# Altium schematic sheet SM3320-BATT-EV.SchDoc: ChangeMe
size C; Date: Not shown in title block; ApprovedBy: Not shown in title block; CheckedBy: Not shown in title block; Author: Not shown in title block; CompanyName: Not shown in title block; DrawnBy: Not shown in title block; Engineer: Not shown in title block; Organization: Not shown in title block; Address1: Not shown in title block; Address2: Not shown in title block; Address3: Not shown in title block; Address4: Not shown in title block; DocumentNumber: 1; Revision: Use project parameter SCH_Rev; SheetNumber: 1; SheetTotal: 1; PageSetup: Record=PageOptions|CenterHorizontal=True|CenterVertical=True|PrintScale=0.85|XCorrection=0.00|YCorrection=0.00|PrintKind=2|BorderSize=5000000|LeftOffset=0|BottomOffset=0|Orientation=2|PaperLength=1000|PaperWidth=1000|Scale=100|PaperSource=15|PrintQuality=600|MediaType=1|DitherType=10|PaperKind=11x17|PrintScaleMode=0; CurrentTime: Not shown in title block; CurrentDate: Not shown in title block; Time: Not shown in title block; DocumentFullPathAndName: Not shown in title block; DocumentName: Not shown in title block; ModifiedDate: Not shown in title block; ImagePath: Not shown in title block
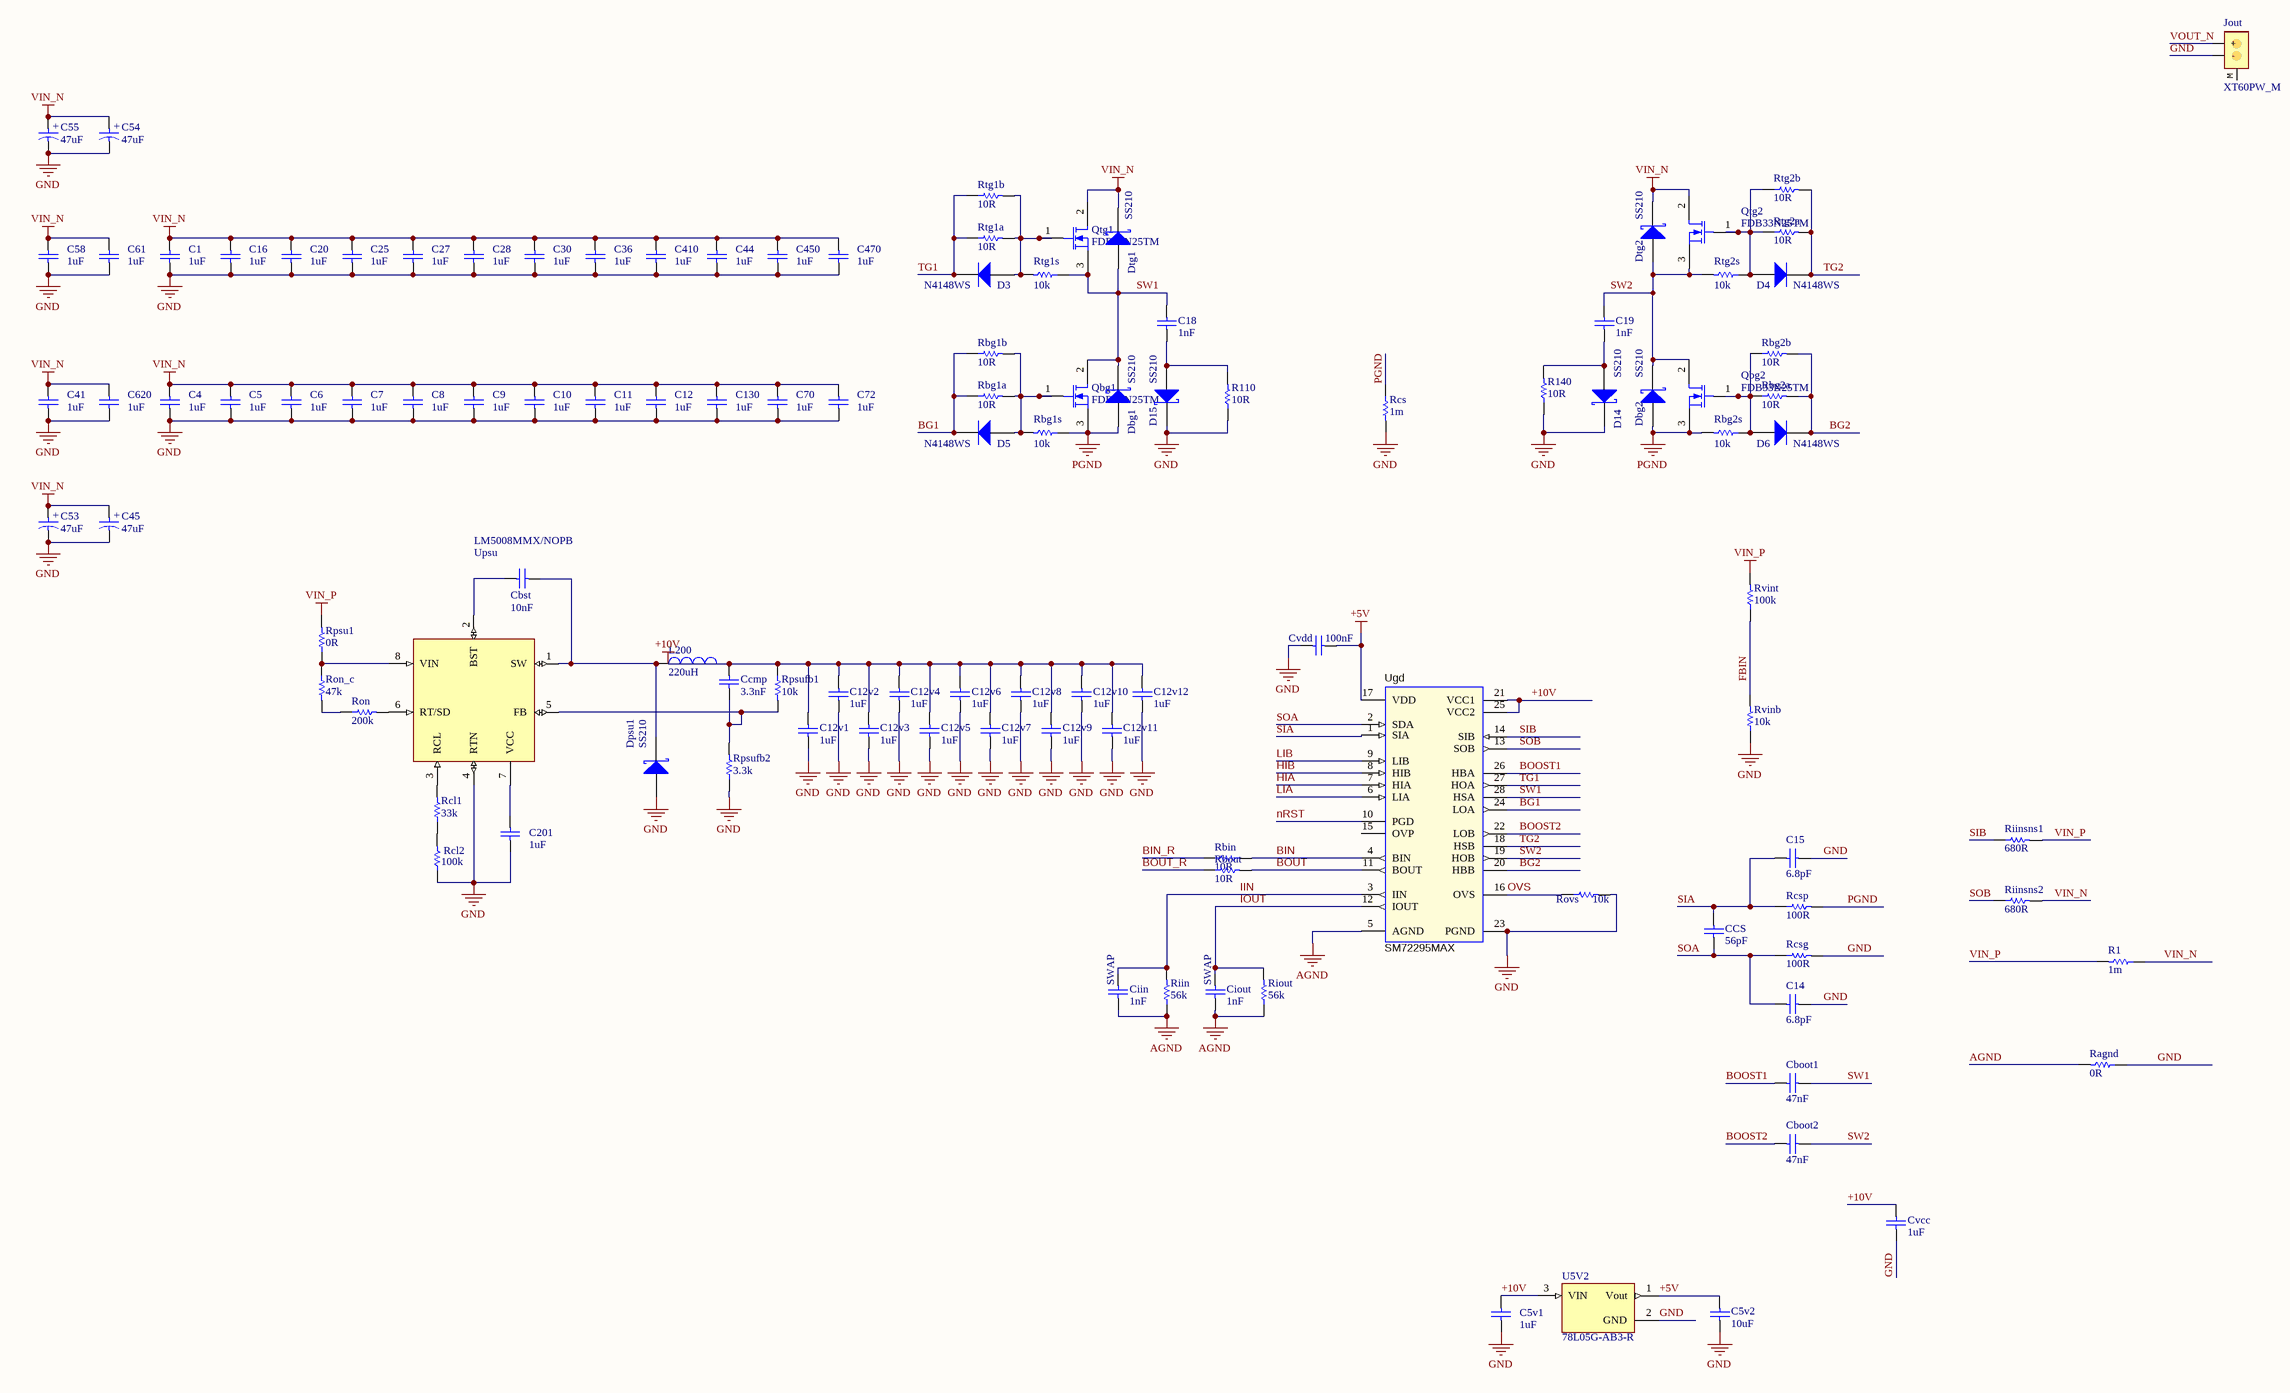
[diagram p0: SM3320-BATT-EV.SchDoc]

## Parts
C1  value 1uF  [C_1206]  (hidden comment: 1206B105K101NT)
C4  value 1uF  [C_1206]  (hidden comment: 1206B105K101NT)
C5  value 1uF  [C_1206]  (hidden comment: 1206B105K101NT)
C5v1  value 1uF  [C_0402]  (hidden comment: CL05A105KA5NQNC)
C5v2  value 10uF  [C_0402]  (hidden comment: CL05A106MQ5NUNC)
C6  value 1uF  [C_1206]  (hidden comment: 1206B105K101NT)
C7  value 1uF  [C_1206]  (hidden comment: 1206B105K101NT)
C8  value 1uF  [C_1206]  (hidden comment: 1206B105K101NT)
C9  value 1uF  [C_1206]  (hidden comment: 1206B105K101NT)
C10  value 1uF  [C_1206]  (hidden comment: 1206B105K101NT)
C11  value 1uF  [C_1206]  (hidden comment: 1206B105K101NT)
C12  value 1uF  [C_1206]  (hidden comment: 1206B105K101NT)
C12v1  value 1uF  [C_0402]  (hidden comment: CL05A105KA5NQNC)
C12v2  value 1uF  [C_0402]  (hidden comment: CL05A105KA5NQNC)
C12v3  value 1uF  [C_0402]  (hidden comment: CL05A105KA5NQNC)
C12v4  value 1uF  [C_0402]  (hidden comment: CL05A105KA5NQNC)
C12v5  value 1uF  [C_0402]  (hidden comment: CL05A105KA5NQNC)
C12v6  value 1uF  [C_0402]  (hidden comment: CL05A105KA5NQNC)
C12v7  value 1uF  [C_0402]  (hidden comment: CL05A105KA5NQNC)
C12v8  value 1uF  [C_0402]  (hidden comment: CL05A105KA5NQNC)
C12v9  value 1uF  [C_0402]  (hidden comment: CL05A105KA5NQNC)
C12v10  value 1uF  [C_0402]  (hidden comment: CL05A105KA5NQNC)
C12v11  value 1uF  [C_0402]  (hidden comment: CL05A105KA5NQNC)
C12v12  value 1uF  [C_0402]  (hidden comment: CL05A105KA5NQNC)
C14  value 6.8pF  [C_0402]  (hidden comment: 0402CG6R8C500NT)
C15  value 6.8pF  [C_0402]  (hidden comment: 0402CG6R8C500NT)
C16  value 1uF  [C_1206]  (hidden comment: 1206B105K101NT)
C18  value 1nF  [C_1206]  (hidden comment: 1206B102K202NT)
C19  value 1nF  [C_1206]  (hidden comment: 1206B102K202NT)
C20  value 1uF  [C_1206]  (hidden comment: 1206B105K101NT)
C25  value 1uF  [C_1206]  (hidden comment: 1206B105K101NT)
C27  value 1uF  [C_1206]  (hidden comment: 1206B105K101NT)
C28  value 1uF  [C_1206]  (hidden comment: 1206B105K101NT)
C30  value 1uF  [C_1206]  (hidden comment: 1206B105K101NT)
C36  value 1uF  [C_1206]  (hidden comment: 1206B105K101NT)
C41  value 1uF  [C_1206]  (hidden comment: 1206B105K101NT)
C44  value 1uF  [C_1206]  (hidden comment: 1206B105K101NT)
C45  value 47uF  [C_CAN_1010]  (hidden comment: VZH470M2ATR-1010)
C53  value 47uF  [C_CAN_1010]  (hidden comment: VZH470M2ATR-1010)
C54  value 47uF  [C_CAN_1010]  (hidden comment: VZH470M2ATR-1010)
C55  value 47uF  [C_CAN_1010]  (hidden comment: VZH470M2ATR-1010)
C58  value 1uF  [C_1206]  (hidden comment: 1206B105K101NT)
C61  value 1uF  [C_1206]  (hidden comment: 1206B105K101NT)
C70  value 1uF  [C_1206]  (hidden comment: 1206B105K101NT)
C72  value 1uF  [C_1206]  (hidden comment: 1206B105K101NT)
C130  value 1uF  [C_1206]  (hidden comment: 1206B105K101NT)
C201  value 1uF  [C_0402]  (hidden comment: CL05A105KA5NQNC)
C410  value 1uF  [C_1206]  (hidden comment: 1206B105K101NT)
C450  value 1uF  [C_1206]  (hidden comment: 1206B105K101NT)
C470  value 1uF  [C_1206]  (hidden comment: 1206B105K101NT)
C620  value 1uF  [C_1206]  (hidden comment: 1206B105K101NT)
Cboot1  value 47nF  [C_0603]  (hidden comment: CL10B474KA8NNNC)
Cboot2  value 47nF  [C_0603]  (hidden comment: CL10B474KA8NNNC)
Cbst  value 10nF  [C_0402]  (hidden comment: CL05B103KB5NNNC)
Ccmp  value 3.3nF  [C_0402]  (hidden comment: CL05B332KB5NNNC)
CCS  value 56pF  [C_0402]  (hidden comment: 0402CG560J500NT)
Ciin  value 1nF  [C_0402]  (hidden comment: 0402B102K500NT)
Ciout  value 1nF  [C_0402]  (hidden comment: 0402B102K500NT)
Cvcc  value 1uF  [C_0402]  (hidden comment: CL05A105KA5NQNC)
Cvdd  value 100nF  [C_0402]  (hidden comment: CL05B104KO5NNNC)
D3  N4148WS  [SOD-323]
D4  N4148WS  [SOD-323]
D5  N4148WS  [SOD-323]
D6  N4148WS  [SOD-323]
D14  SS210  [DO-214AC]
D15  SS210  [DO-214AC]
Dbg1  SS210  [DO-214AC]
Dbg2  SS210  [DO-214AC]
Dpsu1  SS210  [DO-214AC]
Dtg1  SS210  [DO-214AC]
Dtg2  SS210  [DO-214AC]
Jout  XT60PW_M  [XT60PW_M]
L200  value 220uH  [SRR1260]  (hidden comment: SWRB1207S-221MT)
Qbg1  FDB33N25TM  [TO-263-3]
Qbg2  FDB33N25TM  [TO-263-3]
Qtg1  FDB33N25TM  [TO-263-3]
Qtg2  FDB33N25TM  [TO-263-3]
R1  1m  [R_2512]
R110  value 10R  [R_1206]  (hidden comment: 1206W4F100JT5E)
R140  value 10R  [R_1206]  (hidden comment: 1206W4F100JT5E)
Ragnd  value 0R  [R_0402]  (hidden comment: 0402WGF0000TCE)
Rbg1a  value 10R  [R_0402]  (hidden comment: 0402WGF100JTCE)
Rbg1b  value 10R  [R_0402]  (hidden comment: 0402WGF100JTCE)
Rbg1s  value 10k  [R_0402]  (hidden comment: 0402WGF1002TCE)
Rbg2a  value 10R  [R_0402]  (hidden comment: 0402WGF100JTCE)
Rbg2b  value 10R  [R_0402]  (hidden comment: 0402WGF100JTCE)
Rbg2s  value 10k  [R_0402]  (hidden comment: 0402WGF1002TCE)
Rbin  value 10R  [R_0402]  (hidden comment: 0402WGF100JTCE)
Rbout  value 10R  [R_0402]  (hidden comment: 0402WGF100JTCE)
Rcl1  value 33k  [R_0402]  (hidden comment: 0402WGF3302TCE)
Rcl2  value 100k  [R_0402]  (hidden comment: 0402WGF1003TCE)
Rcs  1m  [R_2512]
Rcsg  value 100R  [R_0402]  (hidden comment: 0402WGF1000TCE)
Rcsp  value 100R  [R_0402]  (hidden comment: 0402WGF1000TCE)
Riin  value 56k  [R_0402]  (hidden comment: 0402WGF5602TCE)
Riinsns1  value 680R  [R_0603]  (hidden comment: 0603WAF6800T5E)
Riinsns2  value 680R  [R_0603]  (hidden comment: 0603WAF6800T5E)
Riout  value 56k  [R_0402]  (hidden comment: 0402WGF5602TCE)
Ron  value 200k  [R_0402]  (hidden comment: 0402WGF2003TCE)
Ron_c  value 47k  [R_0402]  (hidden comment: 0402WGF4702TCE)
Rovs  value 10k  [R_0402]  (hidden comment: 0402WGF1002TCE)
Rpsu1  value 0R  [R_0402]  (hidden comment: 0402WGF0000TCE)
Rpsufb1  value 10k  [R_0402]  (hidden comment: 0402WGF1002TCE)
Rpsufb2  value 3.3k  [R_0402]  (hidden comment: 0402WGF3301TCE)
Rtg1a  value 10R  [R_0402]  (hidden comment: 0402WGF100JTCE)
Rtg1b  value 10R  [R_0402]  (hidden comment: 0402WGF100JTCE)
Rtg1s  value 10k  [R_0402]  (hidden comment: 0402WGF1002TCE)
Rtg2a  value 10R  [R_0402]  (hidden comment: 0402WGF100JTCE)
Rtg2b  value 10R  [R_0402]  (hidden comment: 0402WGF100JTCE)
Rtg2s  value 10k  [R_0402]  (hidden comment: 0402WGF1002TCE)
Rvinb  value 10k  [R_0603]  (hidden comment: 0603WAF1002T5E)
Rvint  value 100k  [R_0603]  (hidden comment: 0603WAF100KT5E)
U5V2  78L05G-AB3-R  [SOT-223-3]
Ugd  SM72295MAX  [M28B_M]
Upsu  LM5008MMX/NOPB  [SOP65P490X110-8N]

## Nets
+5V: C5v2.2 Cvdd.2 U5V2.1(Vout) Ugd.17(VDD)
+10V: C5v1.2 C12v1.1 C12v2.1 C12v3.1 C12v4.1 C12v5.1 C12v6.1 C12v7.1 C12v8.1 C12v9.1 C12v10.1 C12v11.1 C12v12.1 Ccmp.2 Cvcc.2 L200.2 Rpsufb1.1 U5V2.3(VIN) Ugd.21(VCC1) Ugd.25(VCC2)
AGND: Ciin.1 Ciout.1 Ragnd.2 Riin.1 Riout.1 Ugd.5(AGND)
GND: C1.1 C4.1 C5.1 C5v1.1 C5v2.1 C6.1 C7.1 C8.1 C9.1 C10.1 C11.1 C12.1 C12v1.2 C12v2.2 C12v3.2 C12v4.2 C12v5.2 C12v6.2 C12v7.2 C12v8.2 C12v9.2 C12v10.2 C12v11.2 C12v12.2 C14.2 C15.2 C16.1 C20.1 C25.1 C27.1 C28.1 C30.1 C36.1 C41.1 C44.1 C45.1 C53.1 C54.1 C55.1 C58.1 C61.1 C70.1 C72.1 C130.1 C201.2 C410.1 C450.1 C470.1 C620.1 Cvcc.1 Cvdd.1 D14.1(K) D15.1(K) Dpsu1.2(A) Jout.MINUS(-) R110.1 R140.1 Ragnd.1 Rcl2.1 Rcs.2 Rcsg.2 Rovs.2 Rpsufb2.1 Rvinb.1 U5V2.2(GND) Ugd.23(PGND) Upsu.4(RTN)
PGND: Dbg1.2(A) Dbg2.2(A) Qbg1.3(S) Qbg2.3(S) Rbg1s.1 Rbg2s.2 Rcs.1 Rcsp.2
VIN_N: C1.2 C4.2 C5.2 C6.2 C7.2 C8.2 C9.2 C10.2 C11.2 C12.2 C16.2 C20.2 C25.2 C27.2 C28.2 C30.2 C36.2 C41.2 C44.2 C45.2 C53.2 C54.2 C55.2 C58.2 C61.2 C70.2 C72.2 C130.2 C410.2 C450.2 C470.2 C620.2 Dtg1.1(K) Dtg2.1(K) Qtg1.2(D) Qtg2.2(D) R1.1 Riinsns2.2
VIN_P: R1.2 Riinsns1.2 Rpsu1.2 Rvint.2
BG1: D5.1(K) Rbg1a.1 Rbg1b.1 Ugd.24(LOA)
BG2: D6.1(K) Rbg2a.2 Rbg2b.2 Ugd.20(HBB)
BIN: Rbin.2 Ugd.4(BIN)
BIN_R: Rbin.1
BOOST1: Cboot1.2 Ugd.26(HBA)
BOOST2: Cboot2.2 Ugd.22(LOB)
BOUT: Rbout.2 Ugd.11(BOUT)
BOUT_R: Rbout.1
FBIN: Rvinb.2 Rvint.1
HIA: Ugd.7(HIA)
HIB: Ugd.8(HIB)
IIN: Ciin.2 Riin.2 Ugd.3(IIN)
IOUT: Ciout.2 Riout.2 Ugd.12(IOUT)
LIA: Ugd.6(LIA)
LIB: Ugd.9(LIB)
nRST: Ugd.10(PGD)
OVS: Rovs.1 Ugd.16(OVS)
SIA: C15.1 CCS.2 Rcsp.1 Ugd.1(SIA)
SIB: Riinsns1.1 Ugd.14(SIB)
SOA: C14.1 CCS.1 Rcsg.1 Ugd.2(SDA)
SOB: Riinsns2.1 Ugd.13(SOB)
SW1: C18.2 Cboot1.1 Dbg1.1(K) Dtg1.2(A) Qbg1.2(D) Qtg1.3(S) Rtg1s.1 Ugd.28(HSA)
SW2: C19.2 Cboot2.1 Dbg2.1(K) Dtg2.2(A) Qbg2.2(D) Qtg2.3(S) Rtg2s.2 Ugd.19(HOB)
TG1: D3.1(K) Rtg1a.1 Rtg1b.1 Ugd.27(HOA)
TG2: D4.1(K) Rtg2a.2 Rtg2b.2 Ugd.18(HSB)
VOUT_N: Jout.PLUS(+)
NetC18_1: C18.1 D15.2(A) R110.2
NetC19_1: C19.1 D14.2(A) R140.2
NetC201_1: C201.1 Upsu.7(VCC)
NetCbst_1: Cbst.1 Upsu.2(BST)
NetCbst_2: Cbst.2 Dpsu1.1(K) L200.1 Upsu.1(SW)
NetCcmp_1: Ccmp.1 Rpsufb1.2 Rpsufb2.2 Upsu.5(FB)
NetD3_2: D3.2(A) Qtg1.1(G) Rtg1a.2 Rtg1b.2 Rtg1s.2
NetD4_2: D4.2(A) Qtg2.1(G) Rtg2a.1 Rtg2b.1 Rtg2s.1
NetD5_2: D5.2(A) Qbg1.1(G) Rbg1a.2 Rbg1b.2 Rbg1s.2
NetD6_2: D6.2(A) Qbg2.1(G) Rbg2a.1 Rbg2b.1 Rbg2s.1
NetRcl1_1: Rcl1.1 Rcl2.2
NetRcl1_2: Rcl1.2 Upsu.3(RCL)
NetRon_1: Ron.1 Ron_c.2
NetRon_2: Ron.2 Upsu.6(RT/SD)
NetRon_c_1: Ron_c.1 Rpsu1.1 Upsu.8(VIN)

Not connected (* = marked no-connect by the designer): Jout M; Ugd 15(OVP)

## Notes on the sheet
- (near Ciin) SWAP
- (near Ciout) SWAP
- Title
- Size:
- Date:
- File:
- C
- Number:
- Time:
- Revision:
- Sheet
- of
- (in symbol VZH470M2ATR-1010) +

## Library data of the parts
C1 C4-C12 C16 C20 C25 C27 C28 C30 C36 C41 C44 C58 C61 C70 C72 C130 C410 C450 C470 C620 = 1206B105K101NT: C - CAPACITOR - MLCC - 1uF - 100V - 1206 - X7R; WVDC: 100; LCSC Part #: C91151; JLC Availability: Extended
C5v1 C12v1-C12v12 C201 Cvcc = CL05A105KA5NQNC: C - CAPACITOR - MLCC - 1uF - 25V - 0402; WVDC: 16; LCSC Part #: C52923; JLC Availability: Basic
C5v2 = CL05A106MQ5NUNC: C - CAPACITOR - MLCC - 10uF - 6.3V - 0402; WVDC: 6.3; LCSC Part #: C15525; JLC Availability: Basic
C14 C15 = 0402CG6R8C500NT: C - CAPACITOR - MLCC - 6.8pF - 50V - 0402; WVDC: 50; LCSC Part #: C1576; JLC Availability: Basic
C18 C19 = 1206B102K202NT: C - CAPACITOR - MLCC - 1nF - 2000V - 1206 - X7R; WVDC: 2000; LCSC Part #: C9196; JLC Availability: Basic
C45 C53-C55 = VZH470M2ATR-1010: C - CAPACITOR - ELECTROLYTIC - 47uF - 100V; WVDC: 100; ESR: 40mOhm; LCSC Part #: C164068; JLC Availability: Extended
Cboot1 Cboot2 = CL10B474KA8NNNC: C - CAPACITOR - MLCC - 470nF - 25V - 0603; WVDC: 25; LCSC Part #: C1623; JLC Availability: Basic
Cbst = CL05B103KB5NNNC: C - CAPACITOR - MLCC - 10nF - 50V - 0402; WVDC: 50; LCSC Part #: C15195; JLC Availability: Basic
Ccmp = CL05B332KB5NNNC: C - CAPACITOR - MLCC - 3.3nF - 50V - 0402; WVDC: 50; LCSC Part #: C26404; JLC Availability: Basic
CCS = 0402CG560J500NT: C - CAPACITOR - MLCC - 56pF - 50V -  0402; WVDC: 50; LCSC Part #: C1572; JLC Availability: Basic
Ciin Ciout = 0402B102K500NT: C - CAPACITOR - MLCC - 1nF - 50V - 0402; WVDC: 50; LCSC Part #: C1523; JLC Availability: Basic
Cvdd = CL05B104KO5NNNC: C - CAPACITOR - MLCC - 100nF - 16V - 0402; WVDC: 16; LCSC Part #: C1525; JLC Availability: Basic
D3-D6 = N4148WS: D - DIODE - FAST TRR - 100V - 150mA - 4ns; LCSC Part #: C2128; JLC Availability: Basic; PIV: 100V; If: 150mA; Trr: 4ns
D14 D15 Dbg1 Dbg2 Dpsu1 Dtg1 Dtg2 = SS210: D - DIODE - SCHOTTKY - 100V - 2A; Vrrm: 100; If: 2A; LCSC Part #: C14996; JLC Availability: Extended
Jout = XT60PW_M: J - JACK - POWER - XT60 - RIGHT - MALE; LCSC Part #: X; JLC Availability: None
L200 = SWRB1207S-221MT: L - INDUCTOR - 220uH - 1.6A - 12.5mm; Isat: 1.6A; LCSC Part #: C169380; JLC Availability: Extended
Qbg1 Qbg2 Qtg1 Qtg2 = FDB33N25TM: Q - TRANSISTOR - MOSFET (N) - 250V - 33A - 0.094R; WVDC: 250; LCSC Part #: C241752; JLC Availability: Extended
R1 Rcs = FMF25FPJR005-LH: R - RESISTOR - SMD - 0.005R - 1% - 2512 - 2W; LCSC Part #: C371096; JLC Availability: Extended; ComponentLink1URL: http://riedon.com/media/pdf/CSR.pdf; ComponentLink1Description: http://riedon.com/media/pdf/CSR.pdf; Power: 2W
R110 R140 = 1206W4F100JT5E: R - RESISTOR - SMD - 10R - 1% - 1206; LCSC Part #: C17903; JLC Availability: Basic
Ragnd Rpsu1 = 0402WGF0000TCE: R - RESISTOR - SMD - 0R - 1% - 0402; LCSC Part #: C17168; JLC Availability: Basic
Rbg1a Rbg1b Rbg2a Rbg2b Rbin Rbout Rtg1a Rtg1b Rtg2a Rtg2b = 0402WGF100JTCE: R - RESISTOR - SMD - 10R - 1% - 0402; LCSC Part #: C25077; JLC Availability: Basic
Rbg1s Rbg2s Rovs Rpsufb1 Rtg1s Rtg2s = 0402WGF1002TCE: R - RESISTOR - SMD - 10k - 1% - 0402; LCSC Part #: C25744; JLC Availability: Basic
Rcl1 = 0402WGF3302TCE: R - RESISTOR - SMD - 33k - 1% - 0402; LCSC Part #: C25779; JLC Availability: Basic
Rcl2 = 0402WGF1003TCE: R - RESISTOR - SMD - 100k - 1% -  0402; LCSC Part #: C25741; JLC Availability: Basic
Rcsg Rcsp = 0402WGF1000TCE: R - RESISTOR - SMD - 100R - 1% - 0402; LCSC Part #: C25076; JLC Availability: Basic
Riin Riout = 0402WGF5602TCE: R - RESISTOR - SMD - 56k - 1% - 0402; LCSC Part #: C25796; JLC Availability: Basic
Riinsns1 Riinsns2 = 0603WAF6800T5E: R - RESISTOR - SMD - 680R - 1% - 0603; LCSC Part #: C23228; JLC Availability: Basic
Ron = 0402WGF2003TCE: R - RESISTOR - SMD - 200k - 1% - 0402; LCSC Part #: C25764; JLC Availability: Basic
Ron_c = 0402WGF4702TCE: R - RESISTOR - SMD - 47k - 1% - 0402; LCSC Part #: C25792; JLC Availability: Basic
Rpsufb2 = 0402WGF3301TCE: R - RESISTOR - SMD - 3.3k - 1% - 0402; LCSC Part #: C25890; JLC Availability: Basic
Rvinb = 0603WAF1002T5E: R - RESISTOR - SMD - 10k - 1% - 0603; LCSC Part #: C25804; JLC Availability: Basic
Rvint = 0603WAF100KT5E: R - RESISTOR - SMD - 100k - 1% -  0603; LCSC Part #: C22936; JLC Availability: Basic
U5V2 = 78L05G-AB3-R: U - IC - 5V Power Regulator; VOut: 5.0; LCSC Part #: C71136; JLC Availability: Basic
Ugd = SM72295: Photovoltaic Full Bridge Driver; Manufacturer: National Semiconductor; PackageTopMarking: S13051; ComponentLink1Description: Solar Magic Website; ComponentLink1URL: http://www.solarmagic.com; CompType: Driver; PackageReference: M28B_N; PartNumber: SM72295; RoHS: Y; PinCount: 28; PackageDescription: SOIC-28
Upsu = LM5008MMX/NOPB: U - IC - BUCK CONVERTER, ADJUSTABLE, 95V, 350mA; Package: None; Price: None; Value: *; MP: LM5008MMX/NOPB; Availability: Unavailable